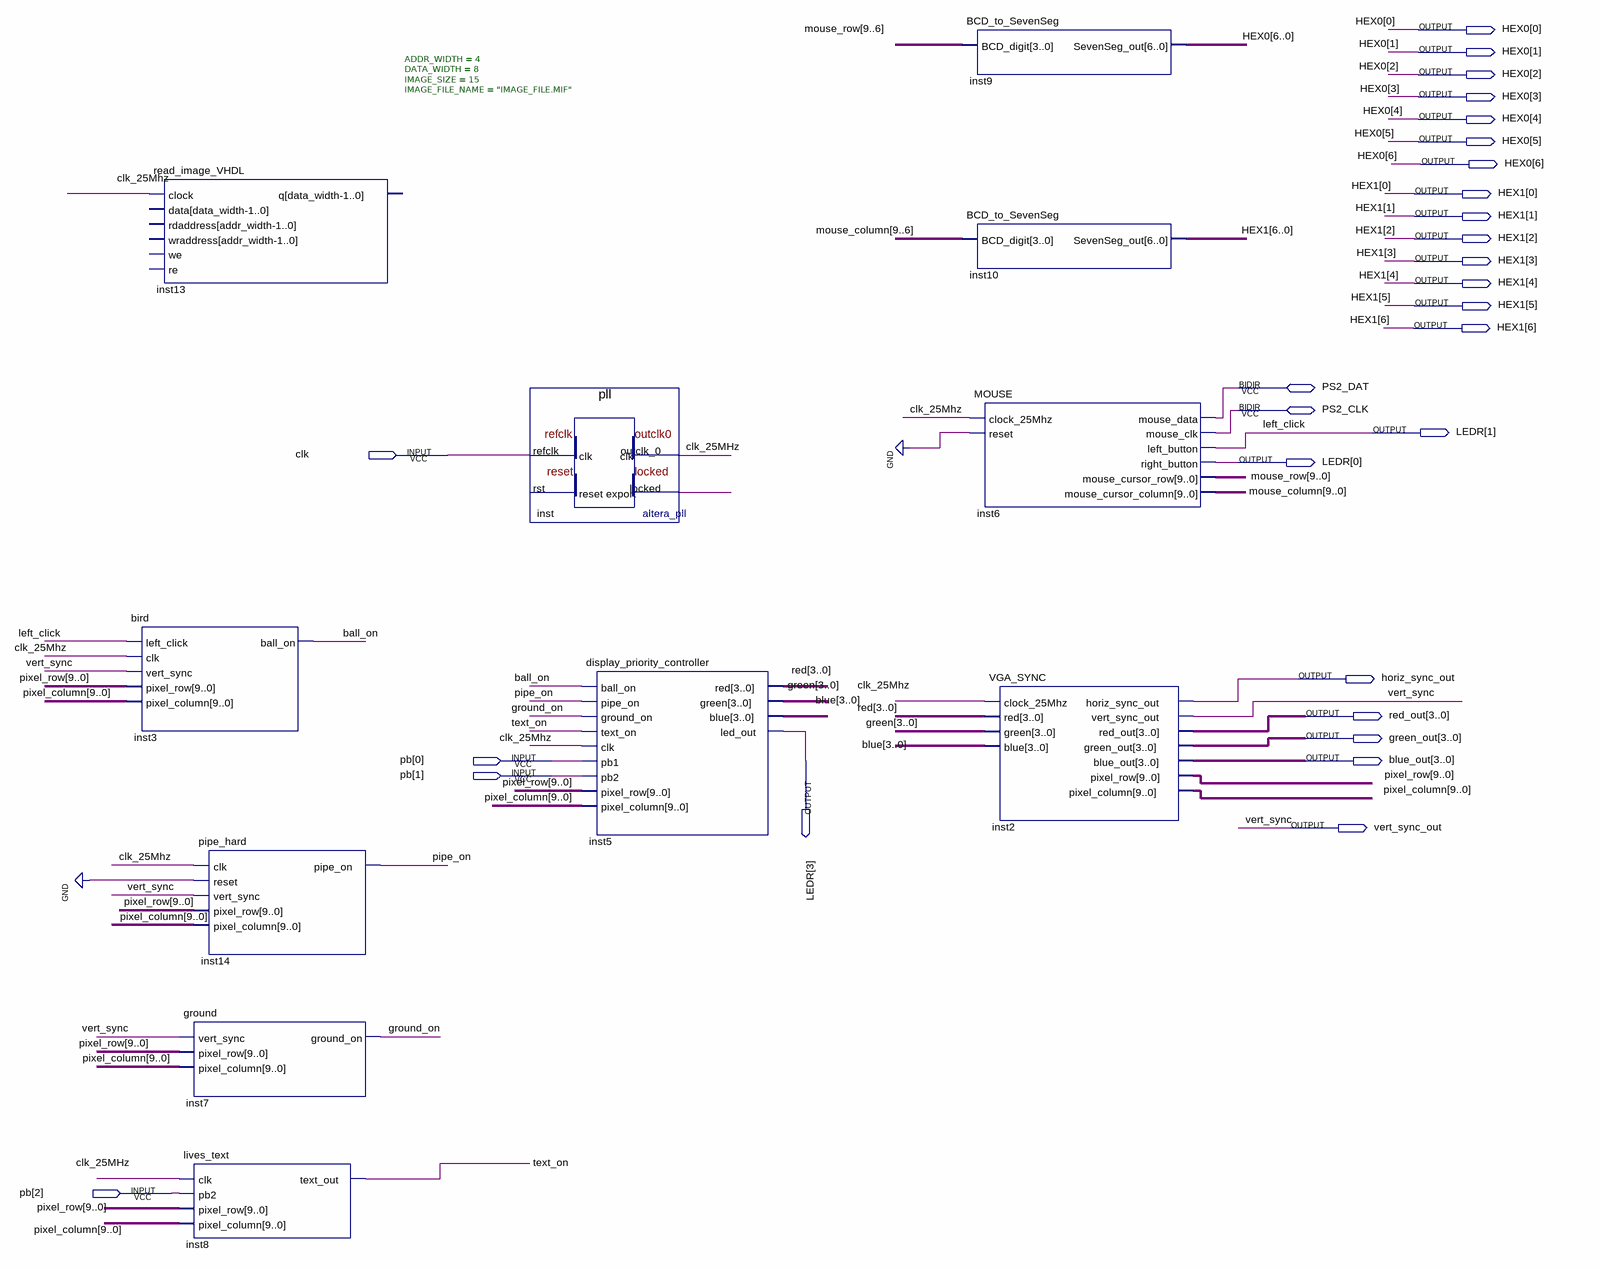
[diagram p0: schematic sheet]
// Quartus schematic flappybird.bdf as structural Verilog: 11 symbols, 28 pins
module flappybird (
  input  clk,
  input  [2:0] pb,
  inout  PS2_DAT,
  inout  PS2_CLK,
  output [6:0] HEX0,
  output [6:0] HEX1,
  output [3:0] LEDR,
  output horiz_sync_out,
  output [3:0] red_out,
  output [3:0] green_out,
  output [3:0] blue_out,
  output vert_sync_out
);

  wire ball_on, clk_25Mhz, ground_on, inst_locked, pipe_on, text_on;
  wire [3:0] blue, green, red;
  wire [9:0] mouse_column, mouse_row, pixel_column, pixel_row;

  bird inst3 (
    .left_click(LEDR[1]), .clk(clk_25Mhz), .vert_sync(vert_sync_out), .pixel_row(pixel_row),
    .pixel_column(pixel_column), .ball_on(ball_on));
  read_image_VHDL #(.ADDR_WIDTH(4), .DATA_WIDTH(8), .IMAGE_SIZE(15), .IMAGE_FILE_NAME("IMAGE_FILE.MIF")) inst13 (.clock(clk_25Mhz));  // open: data, rdaddress, wraddress, we, re, q
  pipe_hard inst14 (
    .clk(clk_25Mhz), .reset(1'b0), .vert_sync(vert_sync_out), .pixel_row(pixel_row),
    .pixel_column(pixel_column), .pipe_on(pipe_on));
  ground inst7 (.vert_sync(vert_sync_out), .pixel_row(pixel_row), .pixel_column(pixel_column), .ground_on(ground_on));
  lives_text inst8 (
    .clk(clk_25Mhz), .pb2(pb[2]), .pixel_row(pixel_row), .pixel_column(pixel_column), .text_out(text_on));
  pll inst (.refclk(clk), .outclk_0(clk_25Mhz), .locked(inst_locked));  // open: rst
  display_priority_controller inst5 (
    .ball_on(ball_on), .pipe_on(pipe_on), .ground_on(ground_on), .text_on(text_on), .clk(clk_25Mhz),
    .pb1(pb[0]), .pb2(pb[1]), .pixel_row(pixel_row), .pixel_column(pixel_column), .red(red), .green(green),
    .blue(blue), .led_out(LEDR[3]));
  BCD_to_SevenSeg inst9 (.BCD_digit(mouse_row[9:6]), .SevenSeg_out(HEX0));
  BCD_to_SevenSeg inst10 (.BCD_digit(mouse_column[9:6]), .SevenSeg_out(HEX1));
  MOUSE inst6 (
    .clock_25Mhz(clk_25Mhz), .reset(1'b0), .left_button(LEDR[1]), .right_button(LEDR[0]),
    .mouse_cursor_row(mouse_row), .mouse_cursor_column(mouse_column), .mouse_data(PS2_DAT),
    .mouse_clk(PS2_CLK));
  VGA_SYNC inst2 (
    .clock_25Mhz(clk_25Mhz), .red(red), .green(green), .blue(blue), .horiz_sync_out(horiz_sync_out),
    .vert_sync_out(vert_sync_out), .red_out(red_out), .green_out(green_out), .blue_out(blue_out),
    .pixel_row(pixel_row), .pixel_column(pixel_column));

  // Other names for the same wires on the sheet: left_click = LEDR[1]; vert_sync = vert_sync_out
endmodule
